# Altium schematic sheet Power.SchDoc
size A4; SheetNumber: 2; SheetTotal: 3
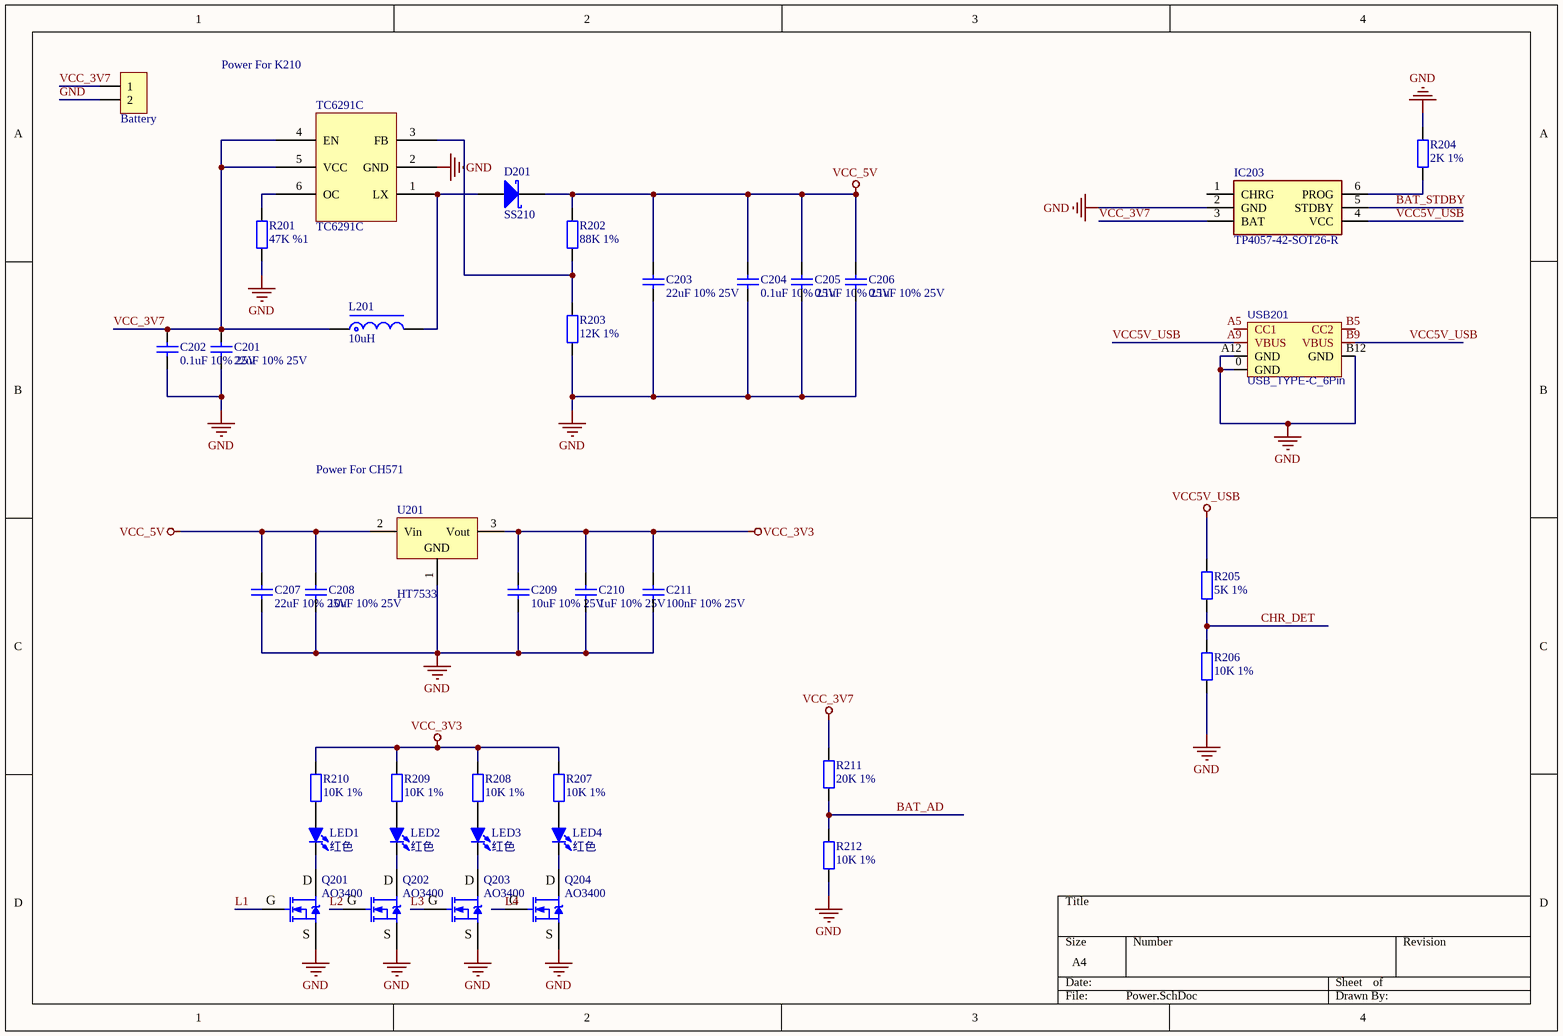
[diagram p0: Power.SchDoc]

## Parts
Battery  HDR-1X2  [ZH1.5-LI-2P]  (value not drawn)
C201  22uF 10% 25V  [C1206_L]
C202  0.1uF 10% 25V  [C0603_L]
C203  22uF 10% 25V  [C1206_L]
C204  0.1uF 10% 25V  [C0603_L]
C205  0.1uF 10% 25V  [C0603_L]
C206  0.1uF 10% 25V  [C0603_L]
C207  22uF 10% 25V  [C1206_L]
C208  10uF 10% 25V  [C0805_L]
C209  10uF 10% 25V  [C0805_L]
C210  1uF 10% 25V  [C0805_L]
C211  100nF 10% 25V  [C0805_L]
D201  SS210  [SMA]
IC203  TP4057-42-SOT26-R  [SOT95P280X125-6N]
L201  10uH  [CD52]
LED1  红色  [LED0805_G]
LED2  红色  [LED0805_G]
LED3  红色  [LED0805_G]
LED4  红色  [LED0805_G]
Q201  AO3400  [SOT23-3N]
Q202  AO3400  [SOT23-3N]
Q203  AO3400  [SOT23-3N]
Q204  AO3400  [SOT23-3N]
R201  47K %1  [R0603_L]
R202  88K 1%  [R0603_L]
R203  12K 1%  [R0603_L]
R204  2K 1%  [R0603_L]
R205  5K 1%  [R0603_L]
R206  10K 1%  [R0603_L]
R207  10K 1%  [R0603_L]
R208  10K 1%  [R0603_L]
R209  10K 1%  [R0603_L]
R210  10K 1%  [R0603_L]
R211  20K 1%  [R0603_L]
R212  10K 1%  [R0603_L]
TC6291C  TC6291C  [SOT23-6]
U201  HT7533  [SOT89_N]
USB201  USB_TYPE-C_6Pin  [USB-C-SMD_6P]

## Nets
GND: Battery.2 C201.1 C202.1 C203.1 C204.1 C205.1 C206.1 C207.1 C208.1 C209.1 C210.1 C211.1 IC203.2(GND) Q201.2(S) Q202.2(S) Q203.2(S) Q204.2(S) R201.1 R203.1 R204.2 R206.1 R212.1 TC6291C.2(GND) U201.1(GND) USB201.0(GND) USB201.A12(GND) USB201.B12(GND)
VCC5V_USB: IC203.4(VCC) R205.2 USB201.A9(VBUS) USB201.B9(VBUS)
VCC_3V3: C209.2 C210.2 C211.2 R207.2 R208.2 R209.2 R210.2 U201.3(Vout)
VCC_3V7: Battery.1 C201.2 C202.2 IC203.3(BAT) L201.1 R211.2 TC6291C.4(EN) TC6291C.5(VCC)
VCC_5V: C203.2 C204.2 C205.2 C206.2 C207.2 C208.2 D201.2(K) R202.2 U201.2(Vin)
BAT_AD: R211.1 R212.2
BAT_STDBY: IC203.5(STDBY)
CHR_DET: R205.1 R206.2
L1: Q201.1(G)
L2: Q202.1(G)
L3: Q203.1(G)
L4: Q204.1(G)
NetD201_1: D201.1(A) L201.2 TC6291C.1(LX)
NetIC203_6: IC203.6(PROG) R204.1
NetLED1_1: LED1.1(A) R210.1
NetLED1_2: LED1.2(K) Q201.3(D)
NetLED2_1: LED2.1(A) R209.1
NetLED2_2: LED2.2(K) Q202.3(D)
NetLED3_1: LED3.1(A) R208.1
NetLED3_2: LED3.2(K) Q203.3(D)
NetLED4_1: LED4.1(A) R207.1
NetLED4_2: LED4.2(K) Q204.3(D)
NetR201_2: R201.2 TC6291C.6(OC)
NetR202_1: R202.1 R203.2 TC6291C.3(FB)

Not connected (* = marked no-connect by the designer): IC203 1(CHRG); USB201 A5(CC1) B5(CC2)

## Notes on the sheet
- Power For K210
- Power For CH571

## Library data of the parts
Battery = Header 2: 2P接插件; 联系卖家，免费查找封装: 唯一出售店铺网址https://shop463601444.taobao.com; BOM名称: 2P接插件
C201-C211 = C: 贴片电容/MLCC电容; BOM名称: 无极性贴片电容; 联系卖家，免费查找封装: 唯一出售店铺网址https://shop463601444.taobao.com
D201 = SS210: 肖特基二极管; 以赠品形式获赠本封装库的买家，还可联系卖家免费指导AD软件使用: 封装库来自淘宝卖家ID：黄晶宝石; BOM名称: 肖特基二极管
IC203 = TP4057-42-SOT26-R: Integrated Circuit; Manufacturer_Name: Nanjing Extension Microelectronics; Datasheet Link: https://datasheet.lcsc.com/szlcsc/Nanjing-Extension-Microelectronics-TP4057_C12044.pdf; Height: 1.25mm; Manufacturer_Part_Number: TP4057-42-SOT26-R
L201 = L-SMD: CD系列贴片线绕功率电感; BOM名称: 功率电感; 联系卖家，免费查找封装: 唯一出售店铺网址https://shop463601444.taobao.com
LED1-LED4 = LED-SMD: 贴片LED; 封装库来自淘宝卖家ID：黄晶宝石: 其他店铺购入均为盗版封装库，请立即申请退款，本店现金奖励20~200元; BOM名称: 贴片LED
Q201-Q204 = AO3400: N沟道 30V/4.2A; BOM名称: 场效应管; 8元以下特价购入的买家: 还可以联系卖家远程指导AD软件使用; 参数: N沟道 30V/4.2A
R201-R212 = R: 贴片电阻; 联系卖家，免费查找封装: 唯一出售店铺网址https://shop463601444.taobao.com; BOM名称: 贴片电阻
U201 = HT7533: LDO线性稳压芯片; 封装库来自淘宝卖家ID：黄晶宝石: 其他店铺购入的买家，请立即申请退款，本店现金奖励20~1000元
USB201 = USB_TYPE-C_6Pin: USB_TYPE-C_6Pin母座; 联系卖家 免费技术支持: 封装库来自淘宝卖家ID：黄晶宝石